# EAGLE schematic design-1v0 (EAGLE 9.5.1)

## Sheet 1 of 2
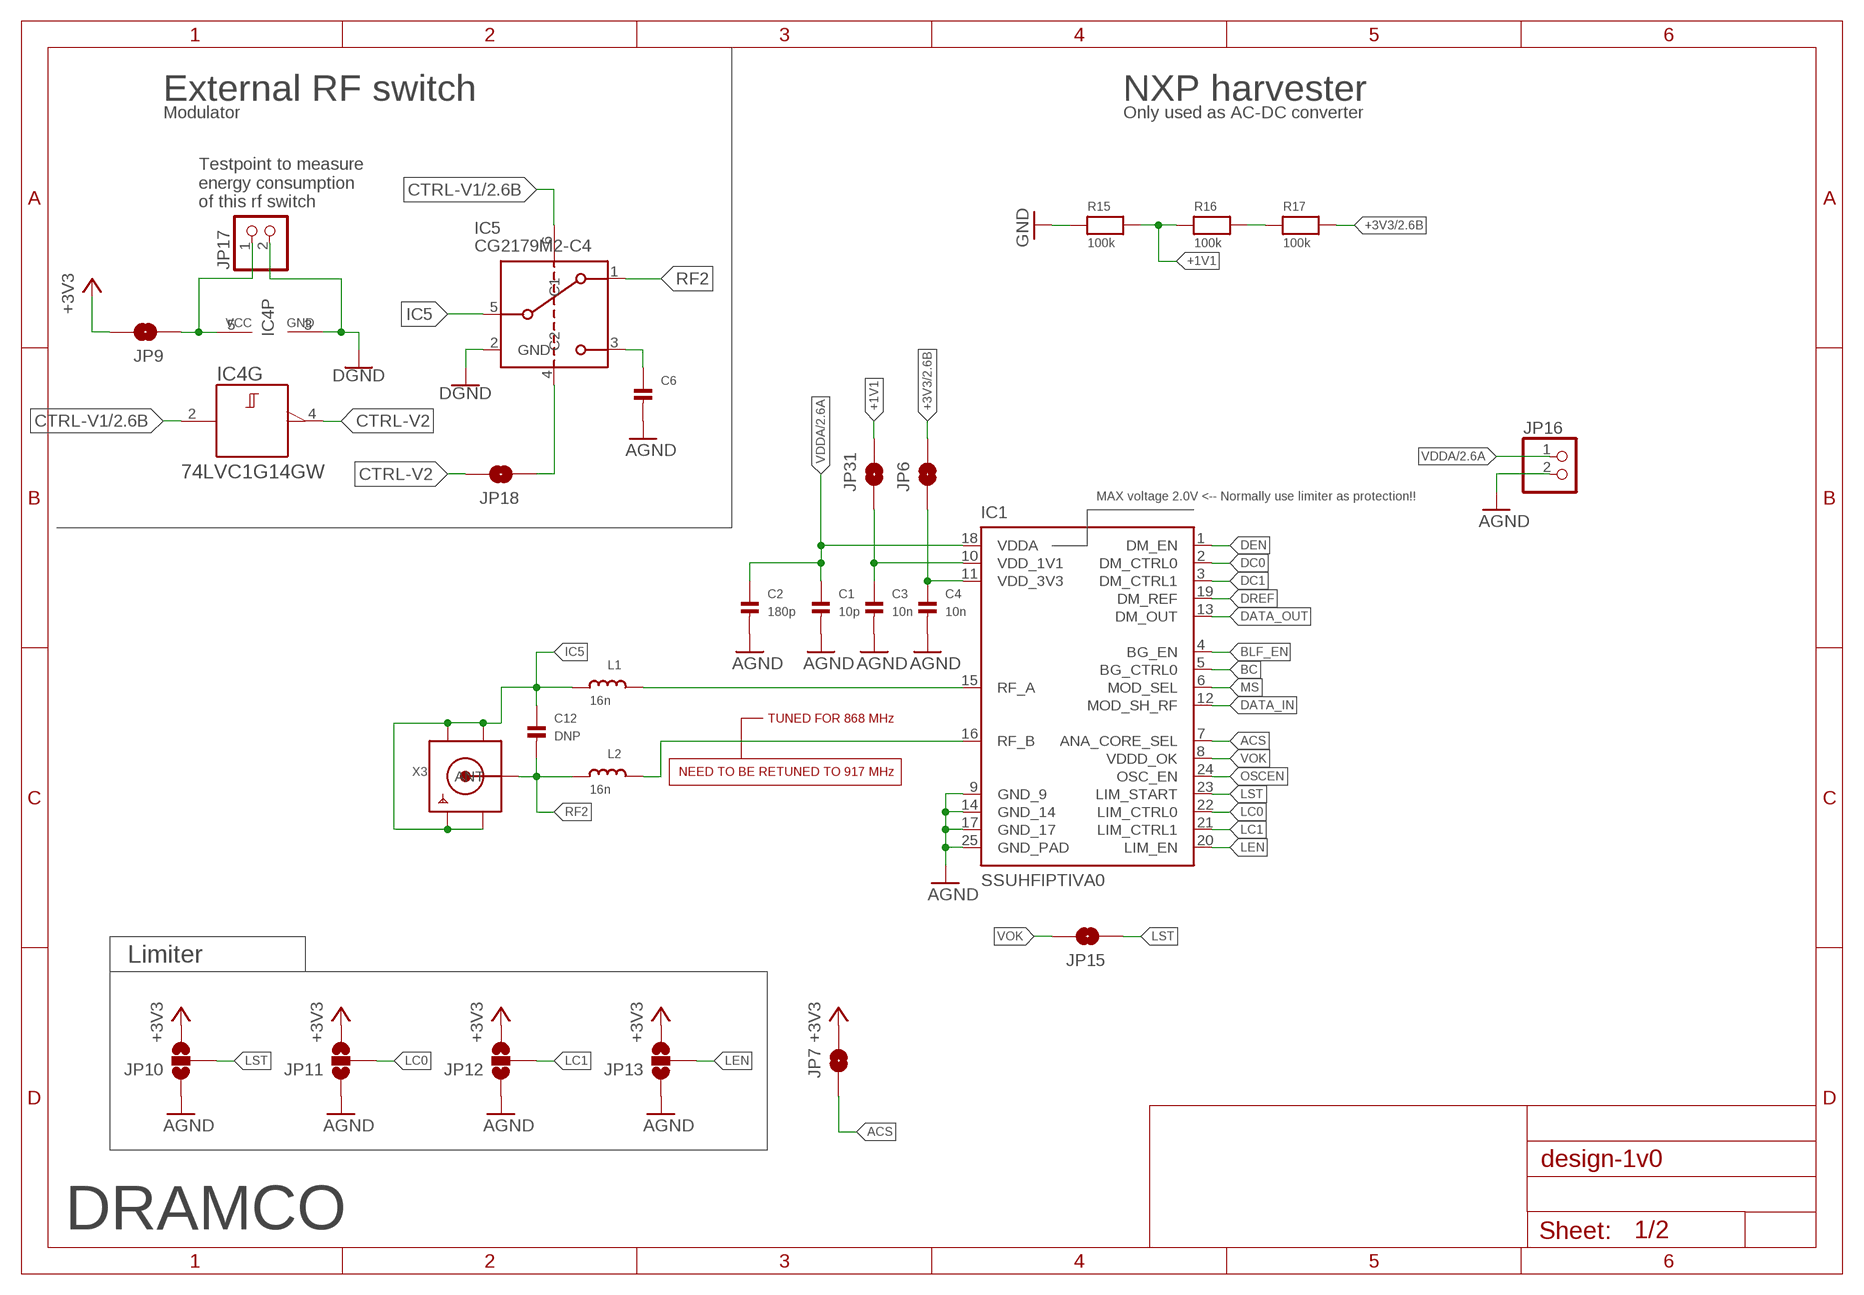
[diagram p0: schematic, sheet 1]

### Parts
C1  10p  CAP_CERAMIC0603  [0603]
C2  180p  CAP_CERAMIC0603  [0603]
C3  10n  CAP_CERAMIC0603  [0603]
C4  10n  CAP_CERAMIC0603  [0603]
C6  CAP_CERAMIC0402  [0402]
C12  DNP  CAP_CERAMIC0402  [0402]
IC1  SSUHFIPTIVA0  [QFN50P400X400X90-25N]
IC4  74LVC1G14GW  [SOT353-1]
IC5  CG2179M2-C4  [SC70-6-CNC04]
JP6  JUMPER-SMT_2_NO_NO-SILK  [SMT-JUMPER_2_NO_NO-SILK]
JP7  JUMPER-SMT_2_NO_NO-SILK  [SMT-JUMPER_2_NO_NO-SILK]
JP9  JUMPER-SMT_2_NO_NO-SILK  [SMT-JUMPER_2_NO_NO-SILK]
JP10  JUMPER-SMT_3_NO_SILK  [SMT-JUMPER_3_NO_SILK]
JP11  JUMPER-SMT_3_NO_SILK  [SMT-JUMPER_3_NO_SILK]
JP12  JUMPER-SMT_3_NO_SILK  [SMT-JUMPER_3_NO_SILK]
JP13  JUMPER-SMT_3_NO_SILK  [SMT-JUMPER_3_NO_SILK]
JP15  JUMPER-SMT_2_NO_NO-SILK  [SMT-JUMPER_2_NO_NO-SILK]
JP16  HEADER-1X2ROUND  [1X02_ROUND]
JP17  HEADER-1X2ROUND  [1X02_ROUND]
JP18  JUMPER-SMT_2_NO_NO-SILK  [SMT-JUMPER_2_NO_NO-SILK]
JP31  JUMPER-SMT_2_NO_NO-SILK  [SMT-JUMPER_2_NO_NO-SILK]
L1  16n  INDUCTOR_0402  [_0402]
L2  16n  INDUCTOR_0402  [_0402]
R15  100k  RESISTOR0603  [0603]
R16  100k  RESISTOR0603  [0603]
R17  100k  RESISTOR0603  [0603]
X3  SMACONNECTOR_EDGE_UFL  [SMA_EDGELAUNCH_UFL]

### Nets
+1V1: JP31.2 R15.2 R16.1
+3V3: JP6.2 JP7.2 JP9.2 JP10.3 JP11.3 JP12.3 JP13.3 R17.2 ; also sheet 2
ACS: IC1.7(ANA_CORE_SEL) JP7.1
AGND: C1.2 C2.2 C3.2 C4.2 C6.2 IC1.9(GND_9) IC1.14(GND_14) IC1.17(GND_17) IC1.25(GND_PAD) JP10.1 JP11.1 JP12.1 JP13.1 JP16.2 ; also sheet 2
BC: IC1.5(BG_CTRL0)
BLF_EN: IC1.4(BG_EN)
CTRL-V1: IC4.2(G:A) IC5.6(C1) ; also sheet 2
CTRL-V2: IC4.4(G:Y) JP18.2
DATA_IN: IC1.12(MOD_SH_RF)
DATA_OUT: IC1.13(DM_OUT)
DC0: IC1.2(DM_CTRL0)
DC1: IC1.3(DM_CTRL1)
DEN: IC1.1(DM_EN)
DREF: IC1.19(DM_REF)
GND: IC4.3(P:GND) IC5.2(GND) JP17.2 R15.1 ; supply symbol labelled DGND ; also sheet 2
IC5: C12.1 IC5.5(PC) L1.1 X3.GND@1(GND1) X3.GND@2(GND2) X3.GND@3(GND3) X3.GND@4(GND4)
LC0: IC1.22(LIM_CTRL0) JP11.2
LC1: IC1.21(LIM_CTRL1) JP12.2
LEN: IC1.20(LIM_EN) JP13.2
LST: IC1.23(LIM_START) JP10.2 JP15.1
MS: IC1.6(MOD_SEL)
N$2: C4.1 IC1.11(VDD_3V3) JP6.1
N$3: C3.1 IC1.10(VDD_1V1) JP31.1
N$4: IC1.15(RF_A) L1.2
N$5: IC1.16(RF_B) L2.2
N$8: IC5.4(C2) JP18.1
N$9: C6.1 IC5.3(P2)
N$14: IC4.5(P:VCC) JP9.1 JP17.1
N$17: R16.2 R17.1
OSCEN: IC1.24(OSC_EN)
RF2: C12.2 IC5.1 L2.1 X3.P(ANT)
VDDA: C1.1 C2.1 IC1.18(VDDA) JP16.1 ; also sheet 2
VOK: IC1.8(VDDD_OK) JP15.2

### Notes on the sheet
- External RF switch | NXP harvester
- Modulator | Only used as AC-DC converter
- Testpoint to measure 
  energy consumption 
  of this rf switch
- MAX voltage 2.0V <-- Normally use limiter as protection!!
- TUNED FOR 868 MHz
- NEED TO BE RETUNED TO 917 MHz
- Limiter
- DRAMCO

## Sheet 2 of 2
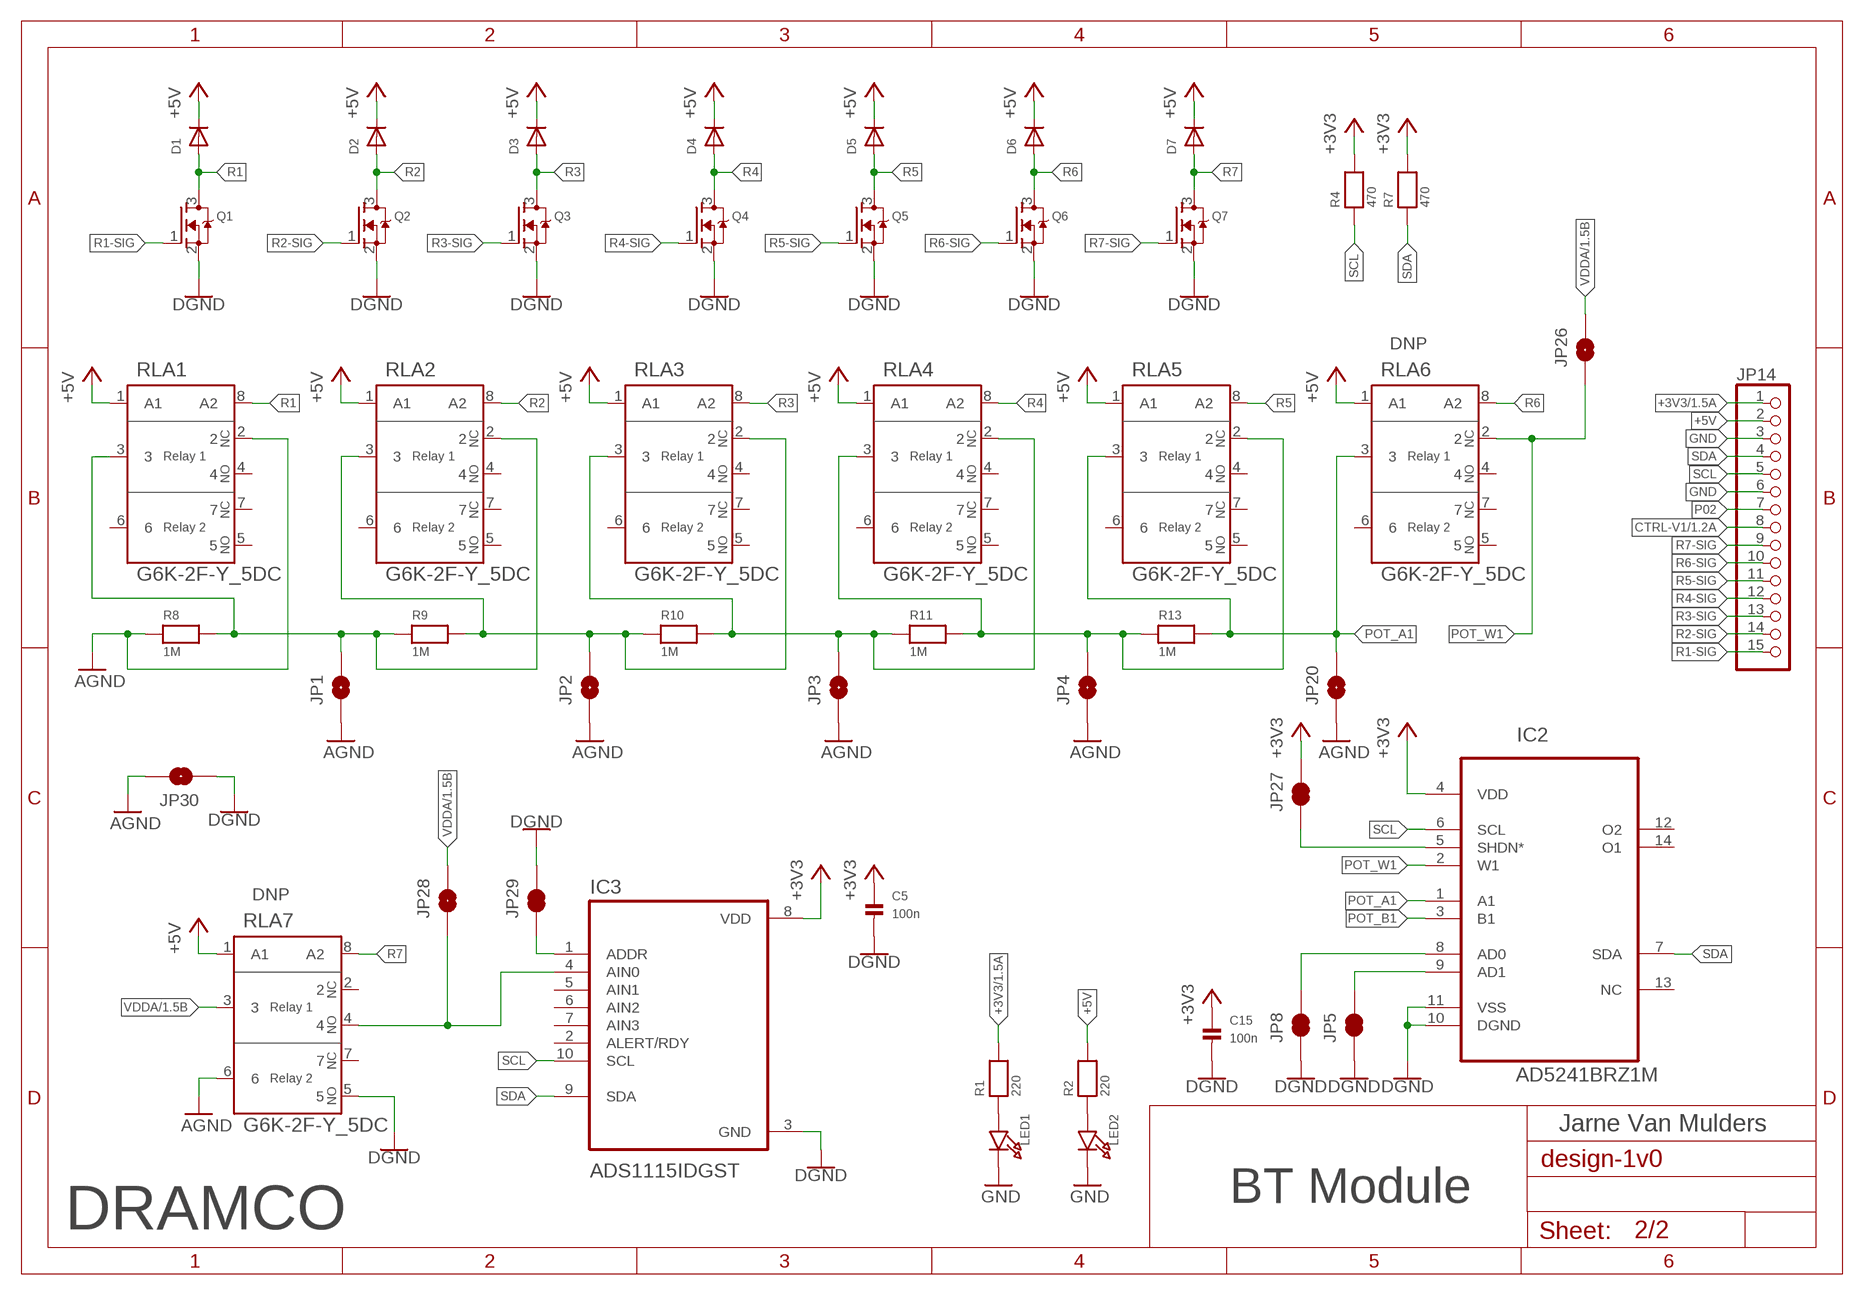
[diagram p1: schematic, sheet 2]

### Parts
C5  100n  CAP_CERAMIC0603  [0603]
C15  100n  CAP_CERAMIC0603  [0603]
D1  DIODESOD-123  [SOD-123]
D2  DIODESOD-123  [SOD-123]
D3  DIODESOD-123  [SOD-123]
D4  DIODESOD-123  [SOD-123]
D5  DIODESOD-123  [SOD-123]
D6  DIODESOD-123  [SOD-123]
D7  DIODESOD-123  [SOD-123]
IC2  AD5241BRZ1M  [SOIC127P600X175-14N]
IC3  ADS1115IDGST  [SOP50P490X110-10N]
JP1  JUMPER-SMT_2_NO_NO-SILK  [SMT-JUMPER_2_NO_NO-SILK]
JP2  JUMPER-SMT_2_NO_NO-SILK  [SMT-JUMPER_2_NO_NO-SILK]
JP3  JUMPER-SMT_2_NO_NO-SILK  [SMT-JUMPER_2_NO_NO-SILK]
JP4  JUMPER-SMT_2_NO_NO-SILK  [SMT-JUMPER_2_NO_NO-SILK]
JP5  JUMPER-SMT_2_NC_TRACE_NO-SILK  [SMT-JUMPER_2_NC_TRACE_NO-SILK]
JP8  JUMPER-SMT_2_NC_TRACE_NO-SILK  [SMT-JUMPER_2_NC_TRACE_NO-SILK]
JP14  HEADER-1X15  [1X15_ROUND_70]
JP20  JUMPER-SMT_2_NO_NO-SILK  [SMT-JUMPER_2_NO_NO-SILK]
JP26  JUMPER-SMT_2_NO_NO-SILK  [SMT-JUMPER_2_NO_NO-SILK]
JP27  JUMPER-SMT_2_NC_TRACE_NO-SILK  [SMT-JUMPER_2_NC_TRACE_NO-SILK]
JP28  JUMPER-SMT_2_NO_NO-SILK  [SMT-JUMPER_2_NO_NO-SILK]
JP29  JUMPER-SMT_2_NC_TRACE_NO-SILK  [SMT-JUMPER_2_NC_TRACE_NO-SILK]
JP30  JUMPER-SMT_2_NO_NO-SILK  [SMT-JUMPER_2_NO_NO-SILK]
LED1  LED0805  [CHIPLED_0805]
LED2  LED0805  [CHIPLED_0805]
Q1  MOSFET-NREFLOW  [SOT23-R]
Q2  MOSFET-NREFLOW  [SOT23-R]
Q3  MOSFET-NREFLOW  [SOT23-R]
Q4  MOSFET-NREFLOW  [SOT23-R]
Q5  MOSFET-NREFLOW  [SOT23-R]
Q6  MOSFET-NREFLOW  [SOT23-R]
Q7  MOSFET-NREFLOW  [SOT23-R]
R1  220  RESISTOR0603  [0603]
R2  220  RESISTOR0603  [0603]
R4  470  RESISTOR0603  [0603]
R7  470  RESISTOR0603  [0603]
R8  1M  RESISTOR0805  [0805]
R9  1M  RESISTOR0805  [0805]
R10  1M  RESISTOR0805  [0805]
R11  1M  RESISTOR0805  [0805]
R13  1M  RESISTOR0805  [0805]
RLA1  G6K-2F-Y_5DC  [RELAY_G6K-2F_OMR]
RLA2  G6K-2F-Y_5DC  [RELAY_G6K-2F_OMR]
RLA3  G6K-2F-Y_5DC  [RELAY_G6K-2F_OMR]
RLA4  G6K-2F-Y_5DC  [RELAY_G6K-2F_OMR]
RLA5  G6K-2F-Y_5DC  [RELAY_G6K-2F_OMR]
RLA6  G6K-2F-Y_5DC  [RELAY_G6K-2F_OMR]
RLA7  G6K-2F-Y_5DC  [RELAY_G6K-2F_OMR]

### Nets
+3V3: C5.1 C15.1 D1.C D2.C D3.C D4.C D5.C D6.C D7.C IC2.4(VDD) IC3.8(VDD) JP14.1 JP27.2 R1.2 R4.2 R7.2 RLA1.1(A1) RLA2.1(A1) RLA3.1(A1) RLA4.1(A1) RLA5.1(A1) RLA6.1(A1) RLA7.1(A1) ; supply symbol labelled +5V ; also sheet 1
+5V: JP14.2 R2.2
AGND: JP1.1 JP2.1 JP3.1 JP4.1 JP20.1 JP30.2 R8.1 RLA1.2 RLA7.6 ; also sheet 1
CTRL-V1: JP14.8 ; also sheet 1
GND: C5.2 C15.2 IC2.10(DGND) IC2.11(VSS) IC3.3(GND) JP5.1 JP8.1 JP14.3 JP14.6 JP29.2 JP30.1 LED1.C LED2.C Q1.2(S) Q2.2(S) Q3.2(S) Q4.2(S) Q5.2(S) Q6.2(S) Q7.2(S) RLA7.5 ; supply symbol labelled DGND ; also sheet 1
N$1: LED2.A R2.1
N$6: JP2.2 R9.2 R10.1 RLA2.3 RLA3.2
N$10: JP1.2 R8.2 R9.1 RLA1.3 RLA2.2
N$12: JP4.2 R11.2 R13.1 RLA4.3 RLA5.2
N$13: IC2.5(SHDN*) JP27.1
N$15: IC2.8(AD0) JP8.2
N$16: IC2.9(AD1) JP5.2
N$20: LED1.A R1.1
N$21: IC3.4(AIN0) JP28.1 RLA7.4
N$22: IC3.1(ADDR) JP29.1
N$24: JP3.2 R10.2 R11.1 RLA3.3 RLA4.2
P02: JP14.7
POT_A1: IC2.1(A1) JP20.2 R13.2 RLA5.3 RLA6.3
POT_B1: IC2.3(B1)
POT_W1: IC2.2(W1) JP26.1 RLA6.2
R1: D1.A Q1.3(D) RLA1.8(A2)
R1-SIG: JP14.15 Q1.1(G)
R2: D2.A Q2.3(D) RLA2.8(A2)
R2-SIG: JP14.14 Q2.1(G)
R3: D3.A Q3.3(D) RLA3.8(A2)
R3-SIG: JP14.13 Q3.1(G)
R4: D4.A Q4.3(D) RLA4.8(A2)
R4-SIG: JP14.12 Q4.1(G)
R5: D5.A Q5.3(D) RLA5.8(A2)
R5-SIG: JP14.11 Q5.1(G)
R6: D6.A Q6.3(D) RLA6.8(A2)
R6-SIG: JP14.10 Q6.1(G)
R7: D7.A Q7.3(D) RLA7.8(A2)
R7-SIG: JP14.9 Q7.1(G)
SCL: IC2.6(SCL) IC3.10(SCL) JP14.5 R4.1
SDA: IC2.7(SDA) IC3.9(SDA) JP14.4 R7.1
VDDA: JP26.2 JP28.2 RLA7.3 ; also sheet 1
Unconnected: IC2.12(O2) IC2.13(NC) IC2.14(O1) IC3.2(ALERT/RDY) IC3.5(AIN1) IC3.6(AIN2) IC3.7(AIN3) RLA1.4 RLA1.5 RLA1.6 RLA1.7 RLA2.4 RLA2.5 RLA2.6 RLA2.7 RLA3.4 RLA3.5 RLA3.6 RLA3.7 RLA4.4 RLA4.5 RLA4.6 RLA4.7 RLA5.4 RLA5.5 RLA5.6 RLA5.7 RLA6.4 RLA6.5 RLA6.6 RLA6.7 RLA7.2 RLA7.7

### Notes on the sheet
- DNP
- DNP
- Jarne Van Mulders
- BT Module
- DRAMCO

## Library data of the parts
C1-C6 C12 C15 = microbuilder:CAP_CERAMIC: Ceramic Capacitors 0402 - 0402 Surface Mount Capacitors 16pF 50V 5% [Digikey: 445-4899-2-ND] 18pF 50V 5% [Digikey: 490-1281-2-ND] 22pF 50V 5% [Digikey: 490-1283-2-ND] 68pF 50V 5% [Digikey: 490-1289-2-ND] 0.1uF 10V 10% [Digikey: 490-1318-2-ND] 1.0uF 6.3V 10% [Digikey: 490-1320-2-ND] 0603 - 0603 Surface Mount Capacitors 16 pF 50V 5% [Digikey: 445-5051-2-ND] 22 pF 50V [Digikey: PCC220ACVTR-ND] 33 pF 50V 5% [Digikey: 490-1415-1-ND] 56pF 50V 5% [Digikey: 490-1421-1-ND] 220pF 50V 5% [Digikey: 445-1285-1-ND] 680 pF 50V 2200 pF 50V 5% C0G [Digikey: 445-1297-1-ND] 5600 pF 100V 5% X7R [Digikey: 478-3711-1-ND] 0.1 µF 25V 10% [Digikey: PCC2277TR-ND] 0.22 µF 16V 10% X7R [Digikey: 445-1318-1-ND] 1.0 µF 25V 10% [Digikey: 445-5146-2-ND] 0603 - RF Specific 3pF 250V +/-0.1pF RF [Digikey: 712-1347-1-ND] 18 pF 250V 5% [Digikey: 478-3505-1-ND or 712-1322-1-ND] 56 pF 250V 5% C0G RF [Digikey: 490-4867-1-ND] 68 pF 250V RF [Digikey: 490-4868-1-ND] 0805 - 0805 Surface Mount Capacitors 220 pF 250V 2% RF Ceramic Capacitor [Digikey: 712-1398-1-ND] 1000 pF 50V 2% NP0 Ceramic Capacitor [Digikey: 478-3760-1-ND] 0.1 µF 25V 10% Ceramic Capacitor [Digikey: PCC1828TR-ND] 1.0 µF 16V 10% Ceramic Capacitor[Digikey: 490-1691-2-ND] 10.0 µF 10V 10% Ceramic Capacitor[Digikey: 709-1228-1-ND] 10.0 uF 16V 10% Ceramic Capacitor [Digikey: 478-5165-2-ND] 47 uF 6.3V 20% Ceramic Capacitor [Digikey: 587-1779-1-ND or 399-5506-1-ND] 1206 - 1206 Surface Mount Capacitors 47uF 10V 20% Ceramic Capacitor [Digikey: 490-5528-1-ND or 399-5508-1-ND or 445-6010-1-ND] 100uF 6.3V -20%, +80% Y5V Ceramic Capacitor (Digikey: 490-4512-1-ND, Mouser: 81-GRM31CF50J107ZE1L)
D1-D7 = microbuilder:DIODE: Diode SMA Model Volts Amps Type Vf Vr Digikey # Notes SSA34-E3 40V 3A Schottky 480mV @ 3A 200uA @ 40V SSA34-E3/61TGITR-ND CDBA120-G 20V 1A Schottky 500mV @ 1A 500uA @ 20V 641-1014-6-ND REEL MBRA210 10V 2A Schottky 350mV @ 2A 700uA @ 10V MBRA210LT3 SOD-123 Model Volts Amps Type Vf Vr Order # Notes BAT54T1G 30V 200mA Schottky 800mV @ 200mA 2uA @ 25V BAT54T1GOSTR-ND B0530W 30V 500mA Schottky 430mV @ 500mA 130uA @ 30V B0530W-FDICT-ND REEL MBR120 1A 20V Schottky 340mV @ 1A MBR120VLSFT1GOSCT-ND SOD-323 Model Volts Amps Type Vf Vr Order # Notes PMEG2005EJ 20V 500mA Schottky 355mV @ 500mA 568-4110-1-ND ZLLS410 10V 570mA Schottky 380mV @ 570mA ZLLS410CT-ND 1N4148WS 75V 150mA Silicon/Simple 1V 1N4148WSFSCT-ND REEL SOD-523 Model Volts Amps Type Vf Vr Order # Notes BAT54XV2 30V 200mA Schottky 0.8V @ 100mA BAT54XV2CT-ND TB751S 30V 30mA Schottky RB751S-40TE61CT-ND SOT23-R/W (R = Solder Paste/Reflow Ovens, W = Hand-Soldering) Model Volts Amps Type Vf Vr Order # Notes BAT54FILM 40V 300mA Schottky 497-7162-1-ND
IC1 = sSUHFIPTIVA0:SSUHFIPTIVA0
IC2 = AD5241BRZ1M:AD5241BRZ1M: I2C Compatible Digital Potentiometer Check availability <https://pricing.snapeda.com/parts/AD5241BRZ1M/Analog%20Devices/view-part?ref=eda>; AVAILABILITY: In Stock; CHECK_PRICES: https://www.snapeda.com/parts/AD5241BRZ1M/Analog+Devices/view-part/?ref=eda; DESCRIPTION: I2C Compatible Digital Potentiometer; MF: Analog Devices; MP: AD5241BRZ1M; PACKAGE: SOIC-14 Analog Devices; PRICE: None; SNAPEDA_LINK: https://www.snapeda.com/parts/AD5241BRZ1M/Analog+Devices/view-part/?ref=snap
IC3 = ADS1115IDGST:ADS1115IDGST: Check prices <https://pricing.snapeda.com/parts/ADS1115IDGST/Texas%20Instruments/view-part?ref=eda>; AVAILABILITY: Good; DESCRIPTION: 16-Bit 860SPS 4-Ch Delta-Sigma ADC With PGA, Oscillator, Vref, Comparator, and I2C 10-VSSOP -40 to 125; MF: Texas Instruments; MP: ADS1115IDGST; PACKAGE: VSSOP-10 Texas Instruments; PRICE: None; PURCHASE-URL: https://pricing.snapeda.com/search/part/ADS1115IDGST/?ref=eda
IC4 = nxp_60_1_1:74LVC1G14: Single Schmitt-trigger inverter The 74LVC1G14 provides the inverting buffer function with Schmitt-trigger input. It is capable of transforming slowly changing input signals into sharply defined, jitter-free output signals. The input can be driven from either 3.3 V or 5 V devices. This feature allows the use of this device in a mixed 3.3 V and 5 V environment. Schmitt-trigger action at the input makes the circuit tolerant for slower input rise and fall time. This device is fully specified for partial power-down applications using IOFF. The IOFF circuitry disables the output, preventing the damaging backflow current through the device when it is powered down. AAL Eindhoven MK; 12NC: 9352 685 95125
IC5 = CG2179M2-C4:CG2179M2-C4: Check availability <https://pricing.snapeda.com/parts/CG2179M2-C4/CEL/view-part?ref=eda>; AVAILABILITY: In Stock; CHECK_PRICES: https://www.snapeda.com/parts/CG2179M2-C4/CEL/view-part/?ref=eda; DESCRIPTION: RF Switch IC 802.11b/g/n/ac SPDT 3 GHz 50Ohm 6-Minimold; MF: CEL; MP: CG2179M2-C4; PACKAGE: SMD-6 CEL; PRICE: None; SNAPEDA_LINK: https://www.snapeda.com/parts/CG2179M2-C4/CEL/view-part/?ref=snap
JP1-JP4 JP6 JP7 JP9 JP15 JP18 JP20 JP26 JP28 JP30 JP31 = SparkFun-Jumpers:JUMPER-SMT_2_NO: Normally open jumper This jumper has two pads in close proximity to each other. Apply solder to close the connection. Round pads are easier to solder for beginners, but are a lot larger. SparkFun Product that uses the round pads: SparkFun EL Sequencer <https://www.sparkfun.com/products/12781>
JP5 JP8 JP27 JP29 = SparkFun-Jumpers:JUMPER-SMT_2_NC_TRACE: Normally closed trace jumper This jumper has a trace between two pads so it's normally closed (NC). Use a razor knife to open the connection. For best results follow the IPC guidelines for cutting traces: Cutout at least 0.063 mm (0.005 in). Remove all loose material to clean up the cut area. Seal the cut with an approved epoxy. Reapply solder to reclose the connection.
JP10-JP13 = SparkFun-Jumpers:JUMPER-SMT_3_NO: Normally open jumper This jumper has three pads in close proximity to each other. Apply solder to close the connection(s).
JP14 = microbuilder:HEADER-1X15: 1x15 Header
JP16 JP17 = microbuilder:HEADER-1X2: PIN HEADER
L1 L2 = microbuilder:INDUCTOR: Inductors 0603: 10nH Ceramic Inductor - microwire antenna/RF (Digikey: 712-1434-2-ND) 0805: 560nH Ceramic Inductor - RF (Digikey: 553-1047-1-ND) 270nH Ceramic Inductor - Q = 40@250MHz, +-5%, 1 Ohm DC Resistance (Digikey: 535-10506-2-ND) 1007 (2518 Metric) SMT: 10µH 10% 250mOhm 820mA 1007 Inductor (Digikey: 587-2189-1-ND) 22µH 10% 500mOhm 580mA 1007 Inductor (Digikey: 587-2190-1-ND) 47µH 10% 950mOhm 420mA 1007 Inductor (Digikey: 587-2191-1-ND) 47µH 5% 100mOhm 1A 1008 Inductor (Digikey: 732-1816-1-ND) 5.0x5.0mm (Taiyo Yuden NR5040 Series) 6.8µH 20% 2.3A 64mOhm Inductor (Digikey: 587-2374-2-ND) 5.0x5.0mm (TDK VLC5045 Series) 4.7µH 20% 3.3A 34mOhm Inductor (Digikey: 445-6526-1-ND) 6.8µH 20% 2.7A 46mOhm Inductor (Digikey: 445-6527-1-ND) 6.0x6.0mm (TDK VLC6045 Series) 4.7µH 20% 3.8A 27mOhm Inductor (Digikey: 445-6538-2-ND) 6.8µH 20% 3A 41mOhm Inductor (Digikey: 445-6540-1-ND) 6.2µH 30% 2.2A 45mOhm Inductor (Digikey: SRR5028-6R2YCT-ND) - Not TDK VLC6045 but footprint should match 6.0x6.0mm (TDK SLF6045 Series) 6.8uH 30% 2A 33mOhm Inductor (Digikey: 445-4572-1-ND, Mouser: 810-SLF645T6R8N2R0PF)
LED1 LED2 = microbuilder:LED: LED 0603 - 0603 Surface Mount Package 2mA: Green LED - Low Power (3.9mcd, 2ma, 1.7Vf) - Digikey: 475-2709-2-ND Orange LED - Low Power (9.8mcd, 2ma, 1.8Vf) - Digikey: 475-1194-2-ND Red LED - Low Power (5mcd, 2ma, 1.8Vf) - Digikey: 475-1195-2-ND Yellow LED - Low Power (7mcd, 2ma, 1.8Vf) - Digikey: 475-1196-2-ND 5mA: Blue LED - Low Power (17mcd, 5ma, 2.9Vf) - Digikey: LNJ937W8CRACT-ND 0805 - 0805 Surface Mount Package 2mA: Red LED (8.8mcd, 2mA, 1.8Vf, Clear) - Low Power [Digikey: 475-2510-1-ND] Green LED (5mcd, 2mA, 1.8Vf, Clear) - Low Power [Digikey: 475-2730-1-ND] Yellow LED (11.3mcd, 2mA, 1.8Vf, Clear) - Low Power [Digikey: 475-2555-1-ND] 20mA: Red LED (104mcd, 20mA, Diffused) - LS R976 [Digikey: 475-1278-6-ND] Red LED (12mcd, 20mA, 2.0Vf, Clear) - APT2012EC [Digikey: 754-1128-1-ND] Green LED (15mcd, 20mA, 2.2Vf, Clear) - APT2012GC [Digikey: 754-1131-1-ND] Orange LED (160mcd, 20mA, 2.1Vf, Clear) - APT2012SECK [Digikey: 754-1130-1-ND] 1206 - 1206 Surface Mount Package Green LED (26mcd, 20mA, Diffused) - LG N971 [Digikey: 475-1407-6-ND] Red LED (15mcd, 20mA, Diffused) - LH N974 [Digikey: 475-1416-6-ND]
Q1-Q7 = microbuilder:MOSFET-N: N-Channel Mosfet LEGEND VDS: Voltage Drain-Source ID: Drain Current RDS(ON): Drain-Source On-State Resistance VGS(TH): Gate-Source Threshold Voltage CISS: Drain-Source Input Capacitance SOT-23 Name VDS ID RDS(ON) VGS(TH) CISS Order Number 2N7002E 60V 260mA 2.5 Ohm 2.5V @ 250uA 26.7pF @ 25V 2N7002ET1GOSTR-ND BSH103 30V 850mA 400 mOhm 400mV @ 1mA 83pF @ 24V BSH103,235-ND BSS138 60V 320mA 1.6 Ohm 1.5V @ 250uA 50pF @ 10V Mouser: 771-BSS138PW115 DMN2075U-7 20V 4.2A 38 mOhm 1V @ 250 uA 594.3pF @ 10V DMN2075U-7DICT-ND * BSS138 good choice for I2C level-shifting
R1 R2 R4 R7-R11 R13 R15-R17 = microbuilder:RESISTOR: Resistors 0402 - 0402 Surface Mount Package 22 Ohm 1% 1/16W [Digikey: 311-22.0LRTR-ND] 33 Ohm 5% 1/16W 1.0K 5% 1/16W 1.5K 5% 1/16W 2.0K 1% 1/16W 10.0K 1% 1/16W [Digikey: 311-10.0KLRTR-ND] 10.0K 5% 1/16W [Digikey: RMCF0402JT10K0TR-ND] 12.1K 1% 1/16W [Digikey: 311-22.0LRTR-ND] 100.0K 5% 1/16W 0603 - 0603 Surface Mount Package 0 Ohm 1/10 Watt 1% Resistor 15 Ohm 1/10 Watt 1% Resistor 33 Ohm 1/10 Watt 1% Resistor 49.9 Ohm 1/10 Watt 1% Resistor 100 Ohm 1/10 Watt 1% Resistor 150 Ohm 1/10 Watt 1% Resistor 240 Ohm 1/10 Watt 1% Resistor 390 Ohm 1/10 Watt 1% Resistor 560 Ohm 1/10 Watt 1% Resistor 680 Ohm 1/10 Watt 1% Resistor 750 Ohm 1/10 Watt 1% Resistor 1.0K Ohm 1/10 Watt 1% Resistor 1.5K Ohm 1/10 Watt 1% Resistor 2.0K Ohm 1/10 Watt 1% Resistor 2.2K Ohm 1/10 Watt 1% Resistor 3.3K Ohm 1/10 Watt 1% Resistor 4.7K Ohm 1/10 Watt 1% Resistor 10.0K Ohm 1/10 Watt 1% Resistor 12.0K Ohm 1/10 Watt 1% Resistor 12.1K Ohm 1/10 Watt 1% Resistor 20.0K Ohm 1/10 Watt 1% Resistor 33.0K Ohm 1/10 Watt 1% Resistor 100.0K Ohm 1/10 Watt 1% Resistor 0805 - 0805 Surface Mount Package 0 Ohm 1/8 Watt 1% Resistor 33 Ohm 1/8 Watt 1% Resistor 100 Ohm 1/8 Watt 1% Resistor 150 Ohm 1/8 Watt 1% Resistor 200 Ohm 1/8 Watt 1% Resistor 240 Ohm 1/8 Watt 1% Resistor 330 Ohm 1/8 Watt 1% Resistor 390 Ohm 1/8 Watt 1% Resistor 470 Ohm 1/8 Watt 1% Resistor 1.0K Ohm 1/8 Watt 1% Resistor 1.5K Ohm 1/8 Watt 1% Resistor 2.0K Ohm 1/8 Watt 1% Resistor 4.7K Ohm 1/8 Watt 1% Resistor 5.1K Ohm 1/8 Watt 1% Resistor 5.6K Ohm 1/8 Watt 1% Resistor 10.0K Ohm 1/8 Watt 1% Resistor 22.0K Ohm 1/8 Watt 1% Resistor 33.0K Ohm 1/8 Watt 1% Resistor 100K Ohm 1/8 Watt 1% Resistor 1206 - 1206 Surface Mount Package 2012 - 2010 Surface Mount Package 0.11 Ohm 1/2 Watt 1% Resistor - Digikey: RHM.11UCT-ND
RLA1-RLA7 = G6K-2F-Y 5DC:G6K-2F-Y_5DC; COPYRIGHT: Copyright (C) 2024 Ultra Librarian. All rights reserved.; MANUFACTURER_PART_NUMBER: G6K-2F-Y 5DC; MFR_NAME: Omron
X3 = adafruit:SMACONNECTOR: SMA Connector 90° DIP SMA Connector, 50 Ohm (4UConnector: 07259)